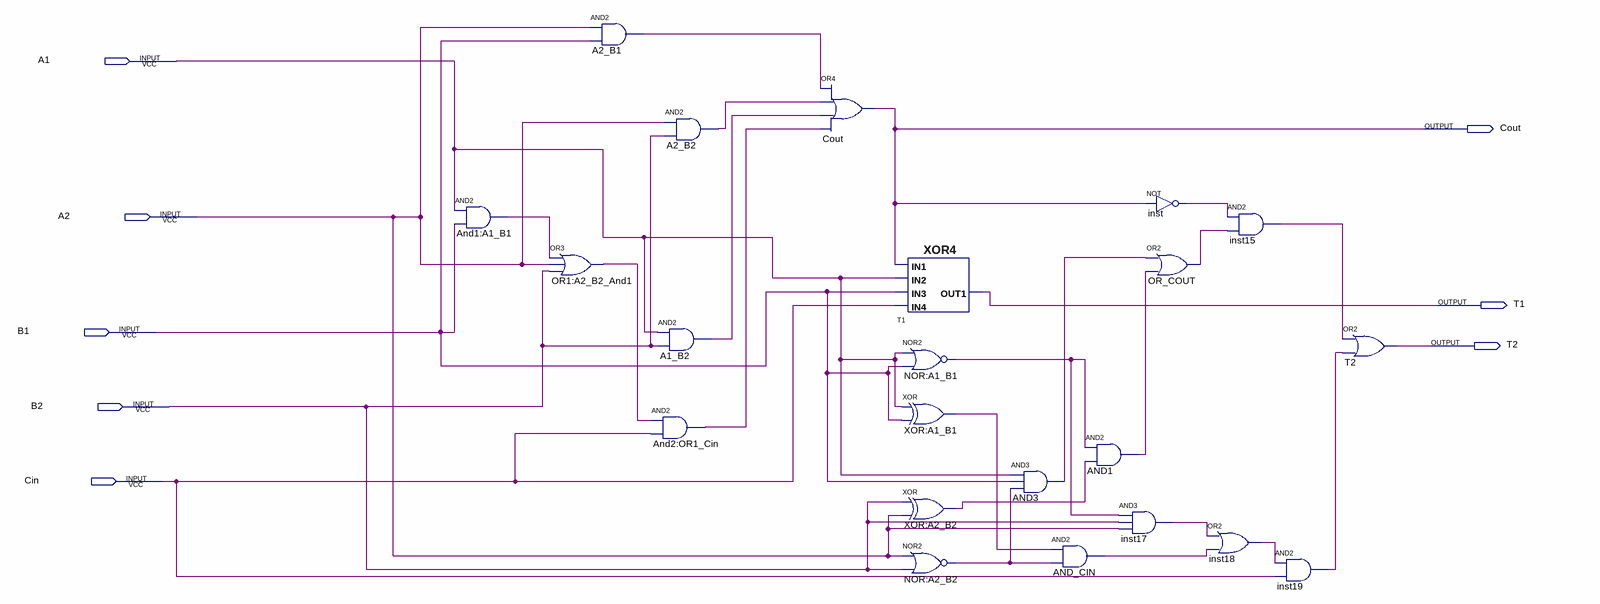
[diagram p0: schematic sheet]
// Quartus schematic FULL_ADDER.bdf as structural Verilog: 22 symbols, 8 pins
module FULL_ADDER (
  input  A1,
  input  A2,
  input  B1,
  input  B2,
  input  Cin,
  output Cout,
  output T1,
  output T2
);

  wire A1_B2_out, A2_B1_out, A2_B2_out, And1_A1_B1_out, AND1_out, And2_OR1_Cin_out, AND3_out, AND_CIN_out,
       inst15_out, inst17_out, inst18_out, inst19_out, inst_out, NOR_A1_B1_out, NOR_A2_B2_out,
       OR1_A2_B2_And1_out, OR_COUT_out, XOR_A1_B1_out, XOR_A2_B2_out;

  and \And1:A1_B1  (And1_A1_B1_out, A1, B1);
  or \OR1:A2_B2_And1  (OR1_A2_B2_And1_out, And1_A1_B1_out, A2, B2);
  and A2_B1 (A2_B1_out, A2, B1);
  and A2_B2 (A2_B2_out, A2, B2);
  and A1_B2 (A1_B2_out, A1, B2);
  and \And2:OR1_Cin  (And2_OR1_Cin_out, OR1_A2_B2_And1_out, Cin);
  or u_Cout (Cout, A2_B1_out, A2_B2_out, A1_B2_out, And2_OR1_Cin_out);
  XOR4 u_T1 (.IN3(B1), .IN4(Cin), .IN2(A1), .IN1(Cout), .OUT1(T1));
  nor \NOR:A1_B1  (NOR_A1_B1_out, A1, B1);
  xor \XOR:A1_B1  (XOR_A1_B1_out, A1, B1);
  xor \XOR:A2_B2  (XOR_A2_B2_out, B2, A2);
  nor \NOR:A2_B2  (NOR_A2_B2_out, A2, B2);
  and AND3 (AND3_out, A1, B1, NOR_A2_B2_out);
  and AND_CIN (AND_CIN_out, XOR_A1_B1_out, NOR_A2_B2_out);
  and AND1 (AND1_out, NOR_A1_B1_out, XOR_A2_B2_out);
  not inst (inst_out, Cout);
  or OR_COUT (OR_COUT_out, AND3_out, AND1_out);
  and inst17 (inst17_out, NOR_A1_B1_out, B2, A2);
  or inst18 (inst18_out, inst17_out, AND_CIN_out);
  and inst15 (inst15_out, inst_out, OR_COUT_out);
  and inst19 (inst19_out, inst18_out, Cin);
  or u_T2 (T2, inst15_out, inst19_out);
endmodule
